# EAGLE design tron_disc (EAGLE 5.11)

## Sheet 1 of 3
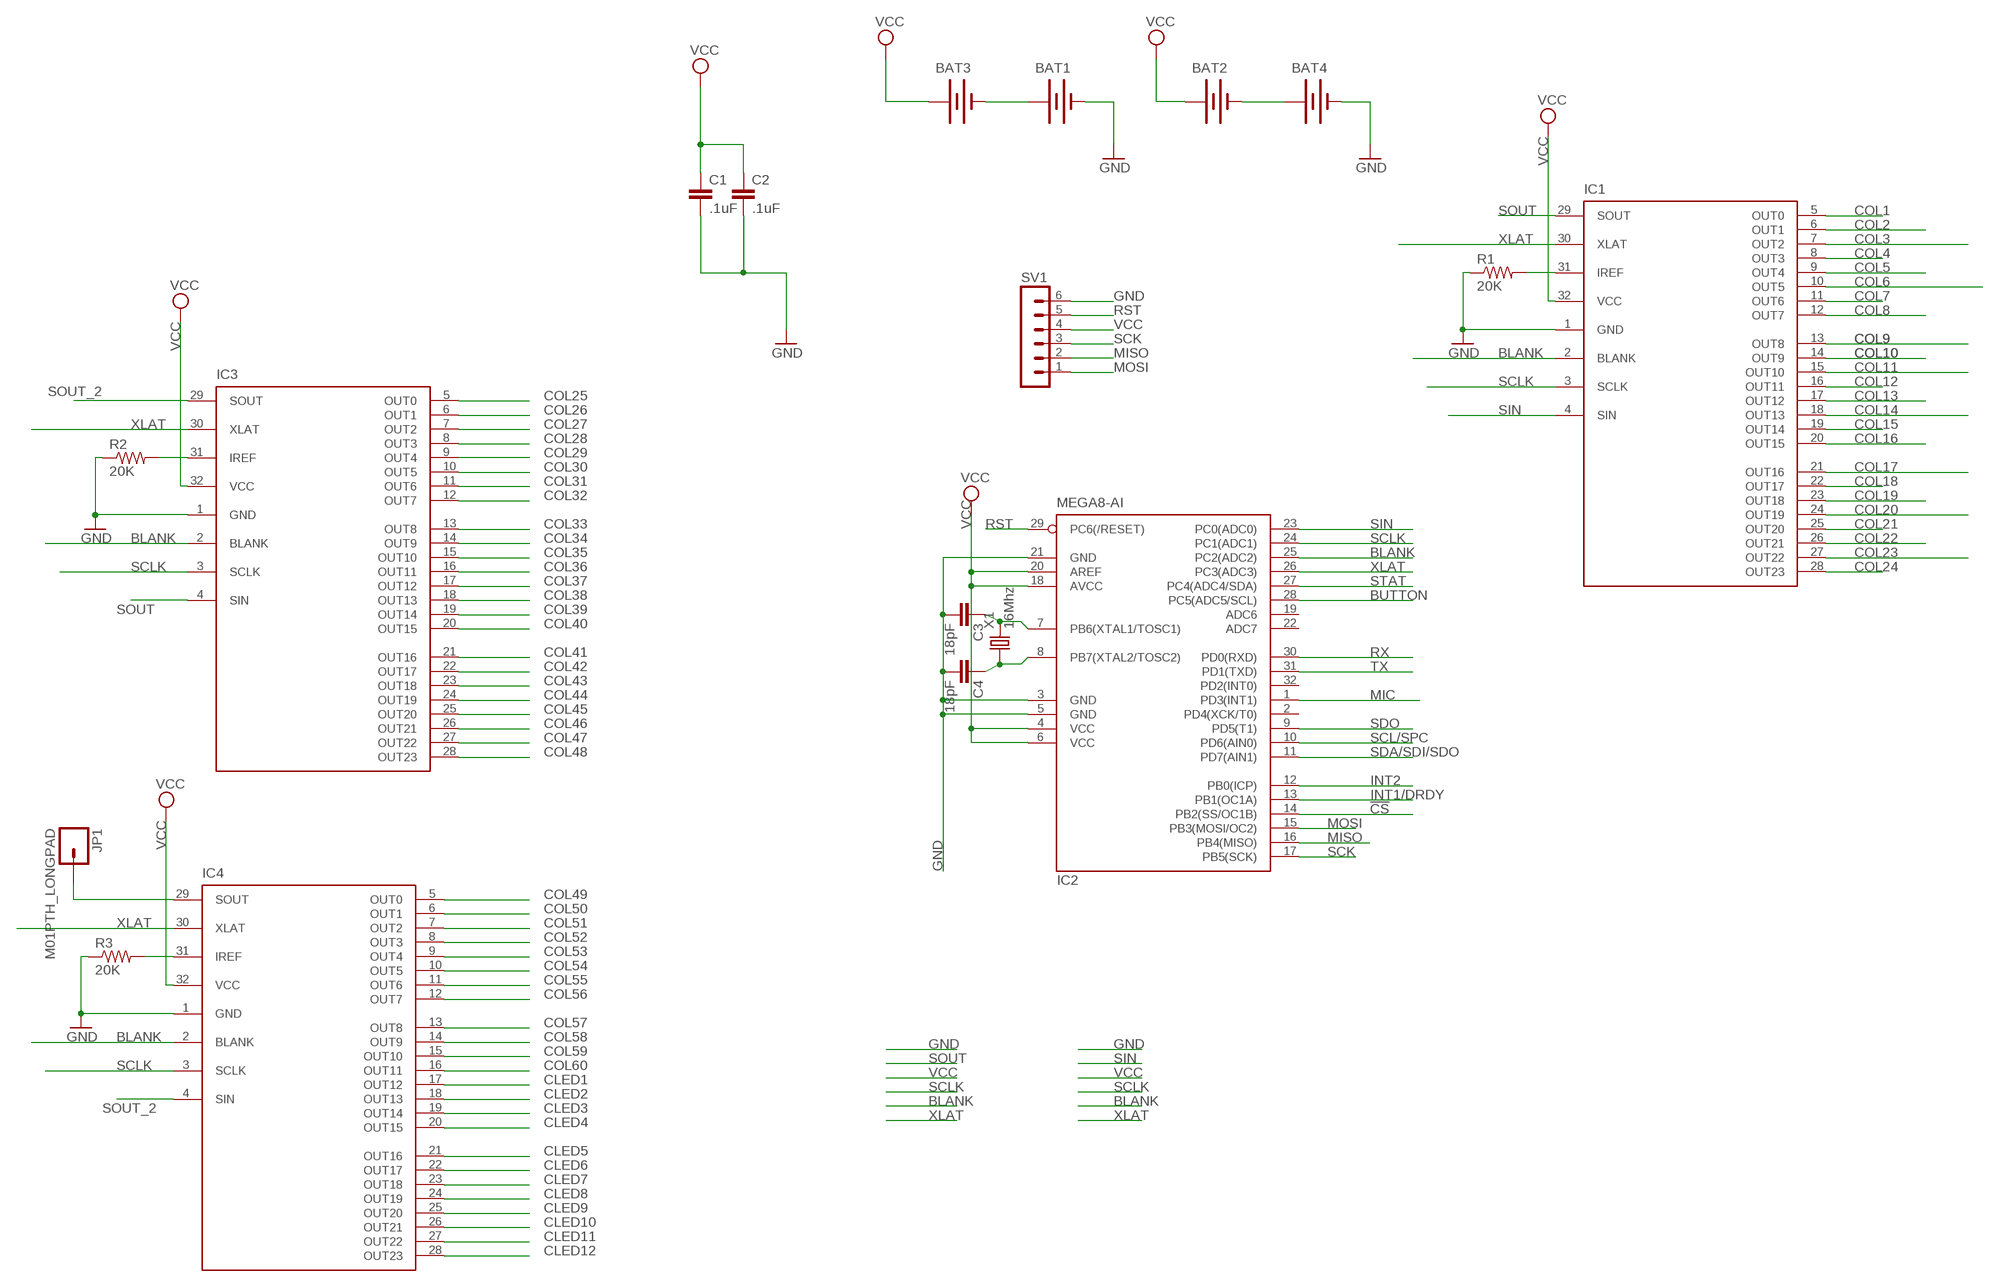
[diagram p0: schematic, sheet 1]

### Parts
BAT1  BATTERY245PTH  [BATTCON_245MM_PTH]
BAT2  BATTERY245PTH  [BATTCON_245MM_PTH]
BAT3  BATTERY245PTH  [BATTCON_245MM_PTH]
BAT4  BATTERY245PTH  [BATTCON_245MM_PTH]
C1  .1uF  CAP0805  [0805]
C2  .1uF  CAP0805  [0805]
C3  18pF  CAP0805  [0805]
C4  18pF  CAP0805  [0805]
IC1  23B_CLOCK_NOLEDS_SLICE_NOSHIFT_TLC5947HTSSOP32DAP  [23B_CLOCK_NOLEDS_HTSSOP32DAP]
IC2  MEGA8-AI  [TQFP32-08]
IC3  23B_CLOCK_NOLEDS_SLICE_NOSHIFT_TLC5947HTSSOP32DAP  [23B_CLOCK_NOLEDS_HTSSOP32DAP]
IC4  23B_CLOCK_NOLEDS_SLICE_NOSHIFT_TLC5947HTSSOP32DAP  [23B_CLOCK_NOLEDS_HTSSOP32DAP]
JP1  M01PTH_LONGPAD  [1X01_LONGPAD]
R1  20K  R-US_R0805  [R0805]
R2  20K  R-US_R0805  [R0805]
R3  20K  R-US_R0805  [R0805]
SV1  MA06-1  [MA06-1]
X1  16Mhz  CRYSTAL-5032  [5032]

### Nets
!CS: IC2.14(PB2(SS/OC1B))
BLANK: IC1.2(BLANK) IC2.25(PC2(ADC2)) IC3.2(BLANK) IC4.2(BLANK)
BUTTON: IC2.28(PC5(ADC5/SCL)) ; also sheet 3
CLED1: IC4.17(OUT12) ; also sheet 2
CLED2: IC4.18(OUT13) ; also sheet 2
CLED3: IC4.19(OUT14) ; also sheet 2
CLED4: IC4.20(OUT15) ; also sheet 2
CLED5: IC4.21(OUT16) ; also sheet 2
CLED6: IC4.22(OUT17) ; also sheet 2
CLED7: IC4.23(OUT18) ; also sheet 2
CLED8: IC4.24(OUT19) ; also sheet 2
CLED9: IC4.25(OUT20) ; also sheet 2
CLED10: IC4.26(OUT21) ; also sheet 2
CLED11: IC4.27(OUT22) ; also sheet 2
CLED12: IC4.28(OUT23) ; also sheet 2
COL1: IC1.5(OUT0) ; also sheet 2
COL2: IC1.6(OUT1) ; also sheet 2
COL3: IC1.7(OUT2) ; also sheet 2
COL4: IC1.8(OUT3) ; also sheet 2
COL5: IC1.9(OUT4) ; also sheet 2
COL6: IC1.10(OUT5) ; also sheet 2
COL7: IC1.11(OUT6) ; also sheet 2
COL8: IC1.12(OUT7) ; also sheet 2
COL9: IC1.13(OUT8) ; also sheet 2
COL10: IC1.14(OUT9) ; also sheet 2
COL11: IC1.15(OUT10) ; also sheet 2
COL12: IC1.16(OUT11) ; also sheet 2
COL13: IC1.17(OUT12) ; also sheet 2
COL14: IC1.18(OUT13) ; also sheet 2
COL15: IC1.19(OUT14) ; also sheet 2
COL16: IC1.20(OUT15) ; also sheet 2
COL17: IC1.21(OUT16) ; also sheet 2
COL18: IC1.22(OUT17) ; also sheet 2
COL19: IC1.23(OUT18) ; also sheet 2
COL20: IC1.24(OUT19) ; also sheet 2
COL21: IC1.25(OUT20) ; also sheet 2
COL22: IC1.26(OUT21) ; also sheet 2
COL23: IC1.27(OUT22) ; also sheet 2
COL24: IC1.28(OUT23) ; also sheet 2
COL25: IC3.5(OUT0) ; also sheet 2
COL26: IC3.6(OUT1) ; also sheet 2
COL27: IC3.7(OUT2) ; also sheet 2
COL28: IC3.8(OUT3) ; also sheet 2
COL29: IC3.9(OUT4) ; also sheet 2
COL30: IC3.10(OUT5) ; also sheet 2
COL31: IC3.11(OUT6) ; also sheet 2
COL32: IC3.12(OUT7) ; also sheet 2
COL33: IC3.13(OUT8) ; also sheet 2
COL34: IC3.14(OUT9) ; also sheet 2
COL35: IC3.15(OUT10) ; also sheet 2
COL36: IC3.16(OUT11) ; also sheet 2
COL37: IC3.17(OUT12) ; also sheet 2
COL38: IC3.18(OUT13) ; also sheet 2
COL39: IC3.19(OUT14) ; also sheet 2
COL40: IC3.20(OUT15) ; also sheet 2
COL41: IC3.21(OUT16) ; also sheet 2
COL42: IC3.22(OUT17) ; also sheet 2
COL43: IC3.23(OUT18) ; also sheet 2
COL44: IC3.24(OUT19) ; also sheet 2
COL45: IC3.25(OUT20) ; also sheet 2
COL46: IC3.26(OUT21) ; also sheet 2
COL47: IC3.27(OUT22) ; also sheet 2
COL48: IC3.28(OUT23) ; also sheet 2
COL49: IC4.5(OUT0) ; also sheet 2
COL50: IC4.6(OUT1) ; also sheet 2
COL51: IC4.7(OUT2) ; also sheet 2
COL52: IC4.8(OUT3) ; also sheet 2
COL53: IC4.9(OUT4) ; also sheet 2
COL54: IC4.10(OUT5) ; also sheet 2
COL55: IC4.11(OUT6) ; also sheet 2
COL56: IC4.12(OUT7) ; also sheet 2
COL57: IC4.13(OUT8) ; also sheet 2
COL58: IC4.14(OUT9) ; also sheet 2
COL59: IC4.15(OUT10) ; also sheet 2
COL60: IC4.16(OUT11) ; also sheet 2
GND: BAT1.2(-) BAT4.2(-) C1.2 C2.2 C3.2 C4.2 IC1.1(GND) IC2.3(GND) IC2.5(GND) IC2.21(GND) IC3.1(GND) IC4.1(GND) R1.1 R2.1 R3.1 SV1.6 ; also sheet 3
INT1/DRDY: IC2.13(PB1(OC1A))
INT2: IC2.12(PB0(ICP))
MIC: IC2.1(PD3(INT1))
MISO: IC2.16(PB4(MISO)) SV1.2
MOSI: IC2.15(PB3(MOSI/OC2)) SV1.1
N$1: IC3.31(IREF) R2.2
N$2: IC4.29(SOUT) JP1.1
N$4: BAT1.3(+) BAT3.2(-)
N$5: BAT2.2(-) BAT4.3(+)
N$7: C3.1 IC2.7(PB6(XTAL1/TOSC1)) X1.2
N$8: C4.1 IC2.8(PB7(XTAL2/TOSC2)) X1.1
N$13: IC1.31(IREF) R1.2
N$64: IC4.31(IREF) R3.2
RST: IC2.29(PC6(/RESET)) SV1.5 ; also sheet 3
RX: IC2.30(PD0(RXD))
SCK: IC2.17(PB5(SCK)) SV1.3
SCL/SPC: IC2.10(PD6(AIN0))
SCLK: IC1.3(SCLK) IC2.24(PC1(ADC1)) IC3.3(SCLK) IC4.3(SCLK)
SDA/SDI/SDO: IC2.11(PD7(AIN1))
SDO: IC2.9(PD5(T1))
SIN: IC1.4(SIN) IC2.23(PC0(ADC0))
SOUT: IC1.29(SOUT) IC3.4(SIN)
SOUT_2: IC3.29(SOUT) IC4.4(SIN)
STAT: IC2.27(PC4(ADC4/SDA))
TX: IC2.31(PD1(TXD))
VCC: BAT2.3(+) BAT3.3(+) C1.1 C2.1 IC1.32(VCC) IC2.4(VCC) IC2.6(VCC) IC2.18(AVCC) IC2.20(AREF) IC3.32(VCC) IC4.32(VCC) SV1.4 ; also sheet 2
XLAT: IC1.30(XLAT) IC2.26(PC3(ADC3)) IC3.30(XLAT) IC4.30(XLAT)
Unconnected: IC2.2(PD4(XCK/T0)) IC2.19(ADC6) IC2.22(ADC7) IC2.32(PD2(INT0))

## Sheet 2 of 3
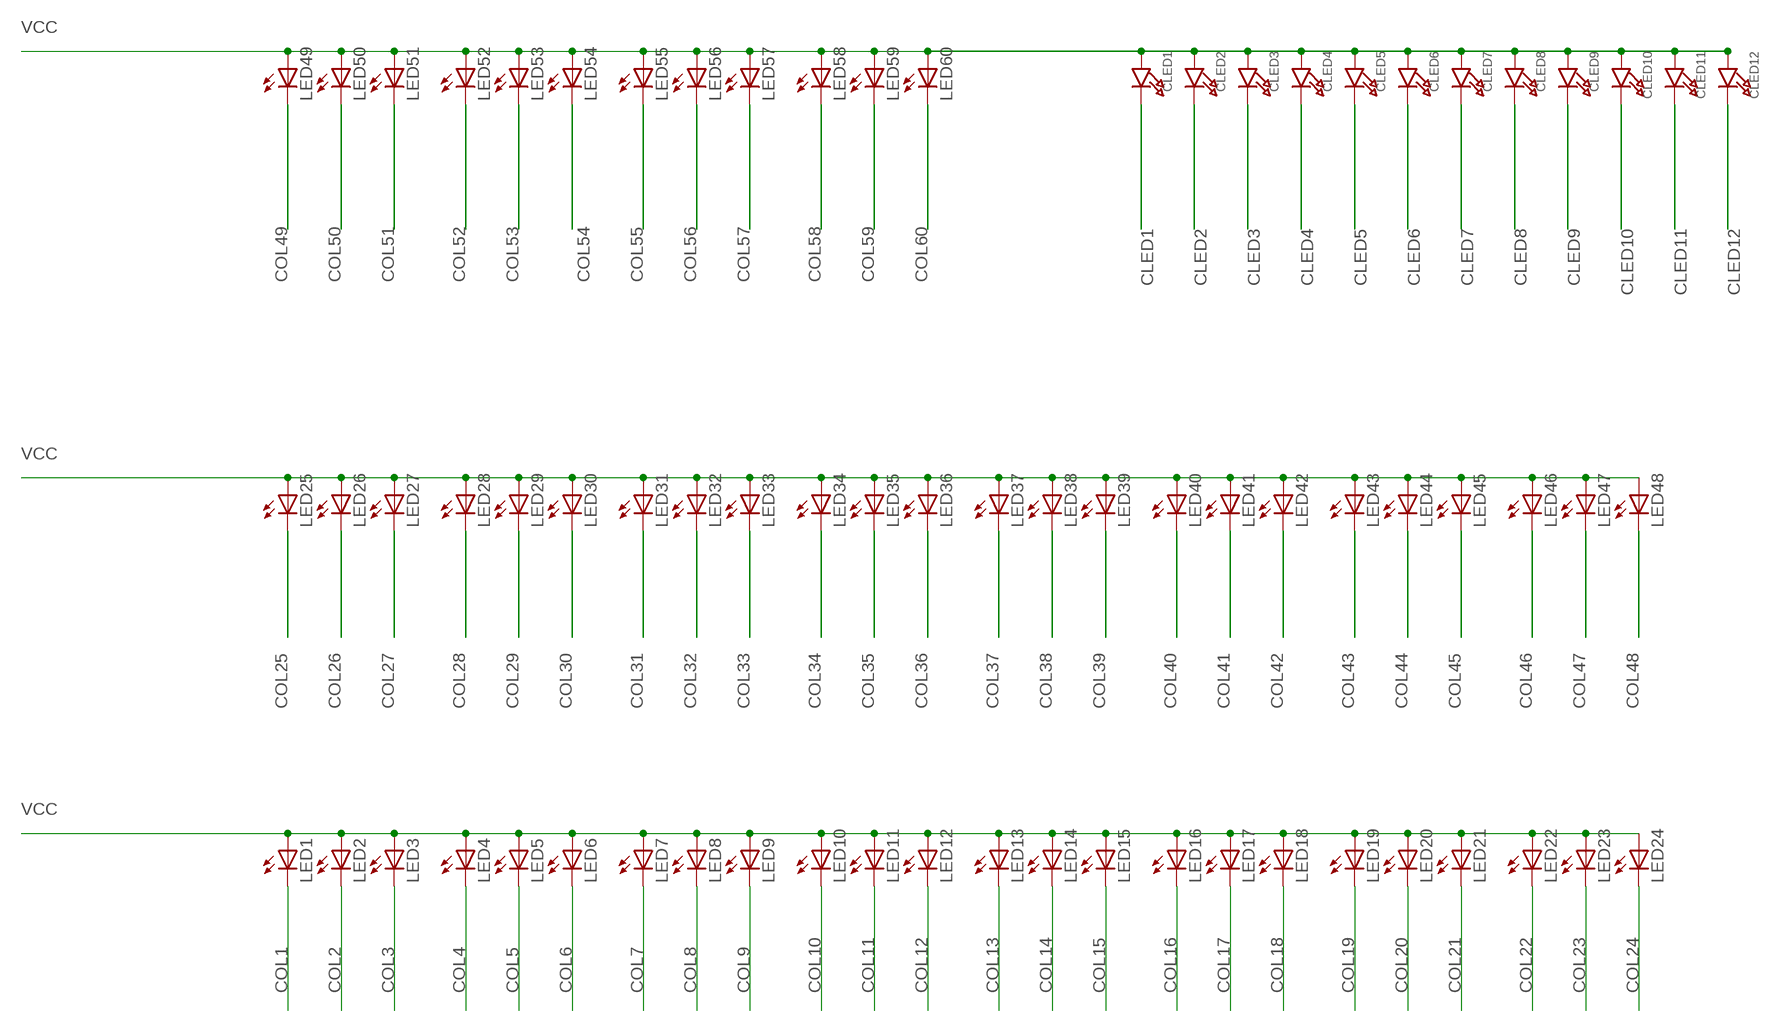
[diagram p1: schematic, sheet 2]

### Parts
CLED1  LED1206  [CHIPLED_1206]
CLED2  LED1206  [CHIPLED_1206]
CLED3  LED1206  [CHIPLED_1206]
CLED4  LED1206  [CHIPLED_1206]
CLED5  LED1206  [CHIPLED_1206]
CLED6  LED1206  [CHIPLED_1206]
CLED7  LED1206  [CHIPLED_1206]
CLED8  LED1206  [CHIPLED_1206]
CLED9  LED1206  [CHIPLED_1206]
CLED10  LED1206  [CHIPLED_1206]
CLED11  LED1206  [CHIPLED_1206]
CLED12  LED1206  [CHIPLED_1206]
LED1  LED5MM  [LED5MM]
LED2  LED5MM  [LED5MM]
LED3  LED5MM  [LED5MM]
LED4  LED5MM  [LED5MM]
LED5  LED5MM  [LED5MM]
LED6  LED5MM  [LED5MM]
LED7  LED5MM  [LED5MM]
LED8  LED5MM  [LED5MM]
LED9  LED5MM  [LED5MM]
LED10  LED5MM  [LED5MM]
LED11  LED5MM  [LED5MM]
LED12  LED5MM  [LED5MM]
LED13  LED5MM  [LED5MM]
LED14  LED5MM  [LED5MM]
LED15  LED5MM  [LED5MM]
LED16  LED5MM  [LED5MM]
LED17  LED5MM  [LED5MM]
LED18  LED5MM  [LED5MM]
LED19  LED5MM  [LED5MM]
LED20  LED5MM  [LED5MM]
LED21  LED5MM  [LED5MM]
LED22  LED5MM  [LED5MM]
LED23  LED5MM  [LED5MM]
LED24  LED5MM  [LED5MM]
LED25  LED5MM  [LED5MM]
LED26  LED5MM  [LED5MM]
LED27  LED5MM  [LED5MM]
LED28  LED5MM  [LED5MM]
LED29  LED5MM  [LED5MM]
LED30  LED5MM  [LED5MM]
LED31  LED5MM  [LED5MM]
LED32  LED5MM  [LED5MM]
LED33  LED5MM  [LED5MM]
LED34  LED5MM  [LED5MM]
LED35  LED5MM  [LED5MM]
LED36  LED5MM  [LED5MM]
LED37  LED5MM  [LED5MM]
LED38  LED5MM  [LED5MM]
LED39  LED5MM  [LED5MM]
LED40  LED5MM  [LED5MM]
LED41  LED5MM  [LED5MM]
LED42  LED5MM  [LED5MM]
LED43  LED5MM  [LED5MM]
LED44  LED5MM  [LED5MM]
LED45  LED5MM  [LED5MM]
LED46  LED5MM  [LED5MM]
LED47  LED5MM  [LED5MM]
LED48  LED5MM  [LED5MM]
LED49  LED5MM  [LED5MM]
LED50  LED5MM  [LED5MM]
LED51  LED5MM  [LED5MM]
LED52  LED5MM  [LED5MM]
LED53  LED5MM  [LED5MM]
LED54  LED5MM  [LED5MM]
LED55  LED5MM  [LED5MM]
LED56  LED5MM  [LED5MM]
LED57  LED5MM  [LED5MM]
LED58  LED5MM  [LED5MM]
LED59  LED5MM  [LED5MM]
LED60  LED5MM  [LED5MM]

### Nets
CLED1: CLED1.C ; also sheet 1
CLED2: CLED2.C ; also sheet 1
CLED3: CLED3.C ; also sheet 1
CLED4: CLED4.C ; also sheet 1
CLED5: CLED5.C ; also sheet 1
CLED6: CLED6.C ; also sheet 1
CLED7: CLED7.C ; also sheet 1
CLED8: CLED8.C ; also sheet 1
CLED9: CLED9.C ; also sheet 1
CLED10: CLED10.C ; also sheet 1
CLED11: CLED11.C ; also sheet 1
CLED12: CLED12.C ; also sheet 1
COL1: LED1.K(C) ; also sheet 1
COL2: LED2.K(C) ; also sheet 1
COL3: LED3.K(C) ; also sheet 1
COL4: LED4.K(C) ; also sheet 1
COL5: LED5.K(C) ; also sheet 1
COL6: LED6.K(C) ; also sheet 1
COL7: LED7.K(C) ; also sheet 1
COL8: LED8.K(C) ; also sheet 1
COL9: LED9.K(C) ; also sheet 1
COL10: LED10.K(C) ; also sheet 1
COL11: LED11.K(C) ; also sheet 1
COL12: LED12.K(C) ; also sheet 1
COL13: LED13.K(C) ; also sheet 1
COL14: LED14.K(C) ; also sheet 1
COL15: LED15.K(C) ; also sheet 1
COL16: LED16.K(C) ; also sheet 1
COL17: LED17.K(C) ; also sheet 1
COL18: LED18.K(C) ; also sheet 1
COL19: LED19.K(C) ; also sheet 1
COL20: LED20.K(C) ; also sheet 1
COL21: LED21.K(C) ; also sheet 1
COL22: LED22.K(C) ; also sheet 1
COL23: LED23.K(C) ; also sheet 1
COL24: LED24.K(C) ; also sheet 1
COL25: LED25.K(C) ; also sheet 1
COL26: LED26.K(C) ; also sheet 1
COL27: LED27.K(C) ; also sheet 1
COL28: LED28.K(C) ; also sheet 1
COL29: LED29.K(C) ; also sheet 1
COL30: LED30.K(C) ; also sheet 1
COL31: LED31.K(C) ; also sheet 1
COL32: LED32.K(C) ; also sheet 1
COL33: LED33.K(C) ; also sheet 1
COL34: LED34.K(C) ; also sheet 1
COL35: LED35.K(C) ; also sheet 1
COL36: LED36.K(C) ; also sheet 1
COL37: LED37.K(C) ; also sheet 1
COL38: LED38.K(C) ; also sheet 1
COL39: LED39.K(C) ; also sheet 1
COL40: LED40.K(C) ; also sheet 1
COL41: LED41.K(C) ; also sheet 1
COL42: LED42.K(C) ; also sheet 1
COL43: LED43.K(C) ; also sheet 1
COL44: LED44.K(C) ; also sheet 1
COL45: LED45.K(C) ; also sheet 1
COL46: LED46.K(C) ; also sheet 1
COL47: LED47.K(C) ; also sheet 1
COL48: LED48.K(C) ; also sheet 1
COL49: LED49.K(C) ; also sheet 1
COL50: LED50.K(C) ; also sheet 1
COL51: LED51.K(C) ; also sheet 1
COL52: LED52.K(C) ; also sheet 1
COL53: LED53.K(C) ; also sheet 1
COL54: LED54.K(C) ; also sheet 1
COL55: LED55.K(C) ; also sheet 1
COL56: LED56.K(C) ; also sheet 1
COL57: LED57.K(C) ; also sheet 1
COL58: LED58.K(C) ; also sheet 1
COL59: LED59.K(C) ; also sheet 1
COL60: LED60.K(C) ; also sheet 1
VCC: CLED1.A CLED2.A CLED3.A CLED4.A CLED5.A CLED6.A CLED7.A CLED8.A CLED9.A CLED10.A CLED11.A CLED12.A LED1.A LED2.A LED3.A LED4.A LED5.A LED6.A LED7.A LED8.A LED9.A LED10.A LED11.A LED12.A LED13.A LED14.A LED15.A LED16.A LED17.A LED18.A LED19.A LED20.A LED21.A LED22.A LED23.A LED24.A LED25.A LED26.A LED27.A LED28.A LED29.A LED30.A LED31.A LED32.A LED33.A LED34.A LED35.A LED36.A LED37.A LED38.A LED39.A LED40.A LED41.A LED42.A LED43.A LED44.A LED45.A LED46.A LED47.A LED48.A LED49.A LED50.A LED51.A LED52.A LED53.A LED54.A LED55.A LED56.A LED57.A LED58.A LED59.A LED60.A ; also sheet 1

## Sheet 3 of 3
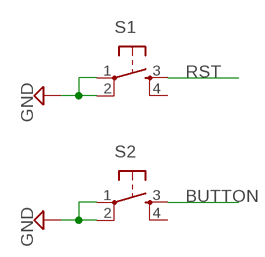
[diagram p2: schematic, sheet 3]

### Parts
S1  TAC_SWITCHSMD  [TACTILE_SWITCH_SMD]
S2  TAC_SWITCHSMD  [TACTILE_SWITCH_SMD]

### Nets
BUTTON: S2.3 ; also sheet 1
GND: S1.1 S1.2 S2.1 S2.2 ; also sheet 1
RST: S1.3 ; also sheet 1
Unconnected: S1.4 S2.4

## Library data of the parts
BAT1-BAT4 = SparkFun:BATTERY: Battery Holders Various common sizes : AA, AAA, 20mm coin cell and 12mm coin cell.
C1-C4 = slice_noshift:CAP: Capacitor Standard 0603 ceramic capacitor, and 0.1" leaded capacitor.
CLED1-CLED12 = microbuilder:LED: LED
IC1 IC3 IC4 = tron_disc:23B_CLOCK_NOLEDS_SLICE_NOSHIFT_TLC5947
IC2 = atmel:MEGA8: MICROCONTROLLER 8 Kbytes FLASH, 1 kbytes SRAM, 512 bytes EEPROM, USART, 6-channel 10 bit ADC, 2-channel 8 bit ADC Pin compatible with Atmega48, ATMega88, ATMega168 Source: avr.lbr; MPN: ATMEGA8-16AU; OC_FARNELL: 9171371; OC_NEWARK: 73M8863
JP1 = SparkFun:M01: Header 1 Standard 1-pin 0.1" header. Use with straight break away headers (SKU : PRT-00116), right angle break away headers (PRT-00553), swiss pins (PRT-00743), machine pins (PRT-00117), and female headers (PRT-00115).
LED1-LED60 = led:LED: LED
R1-R3 = rcl:R-US_: RESISTOR, American symbol
S1 S2 = SparkFun:TAC_SWITCH: Momentary Switch Button commonly used for reset or general input. Spark Fun Electronics SKU : COM-00097
SV1 = NSL:MA06-1: PIN HEADER
X1 = NSL_MiniQuad:CRYSTAL*: CRYSTAL

## Net classes
0 default: width 0.254 mm

## Board
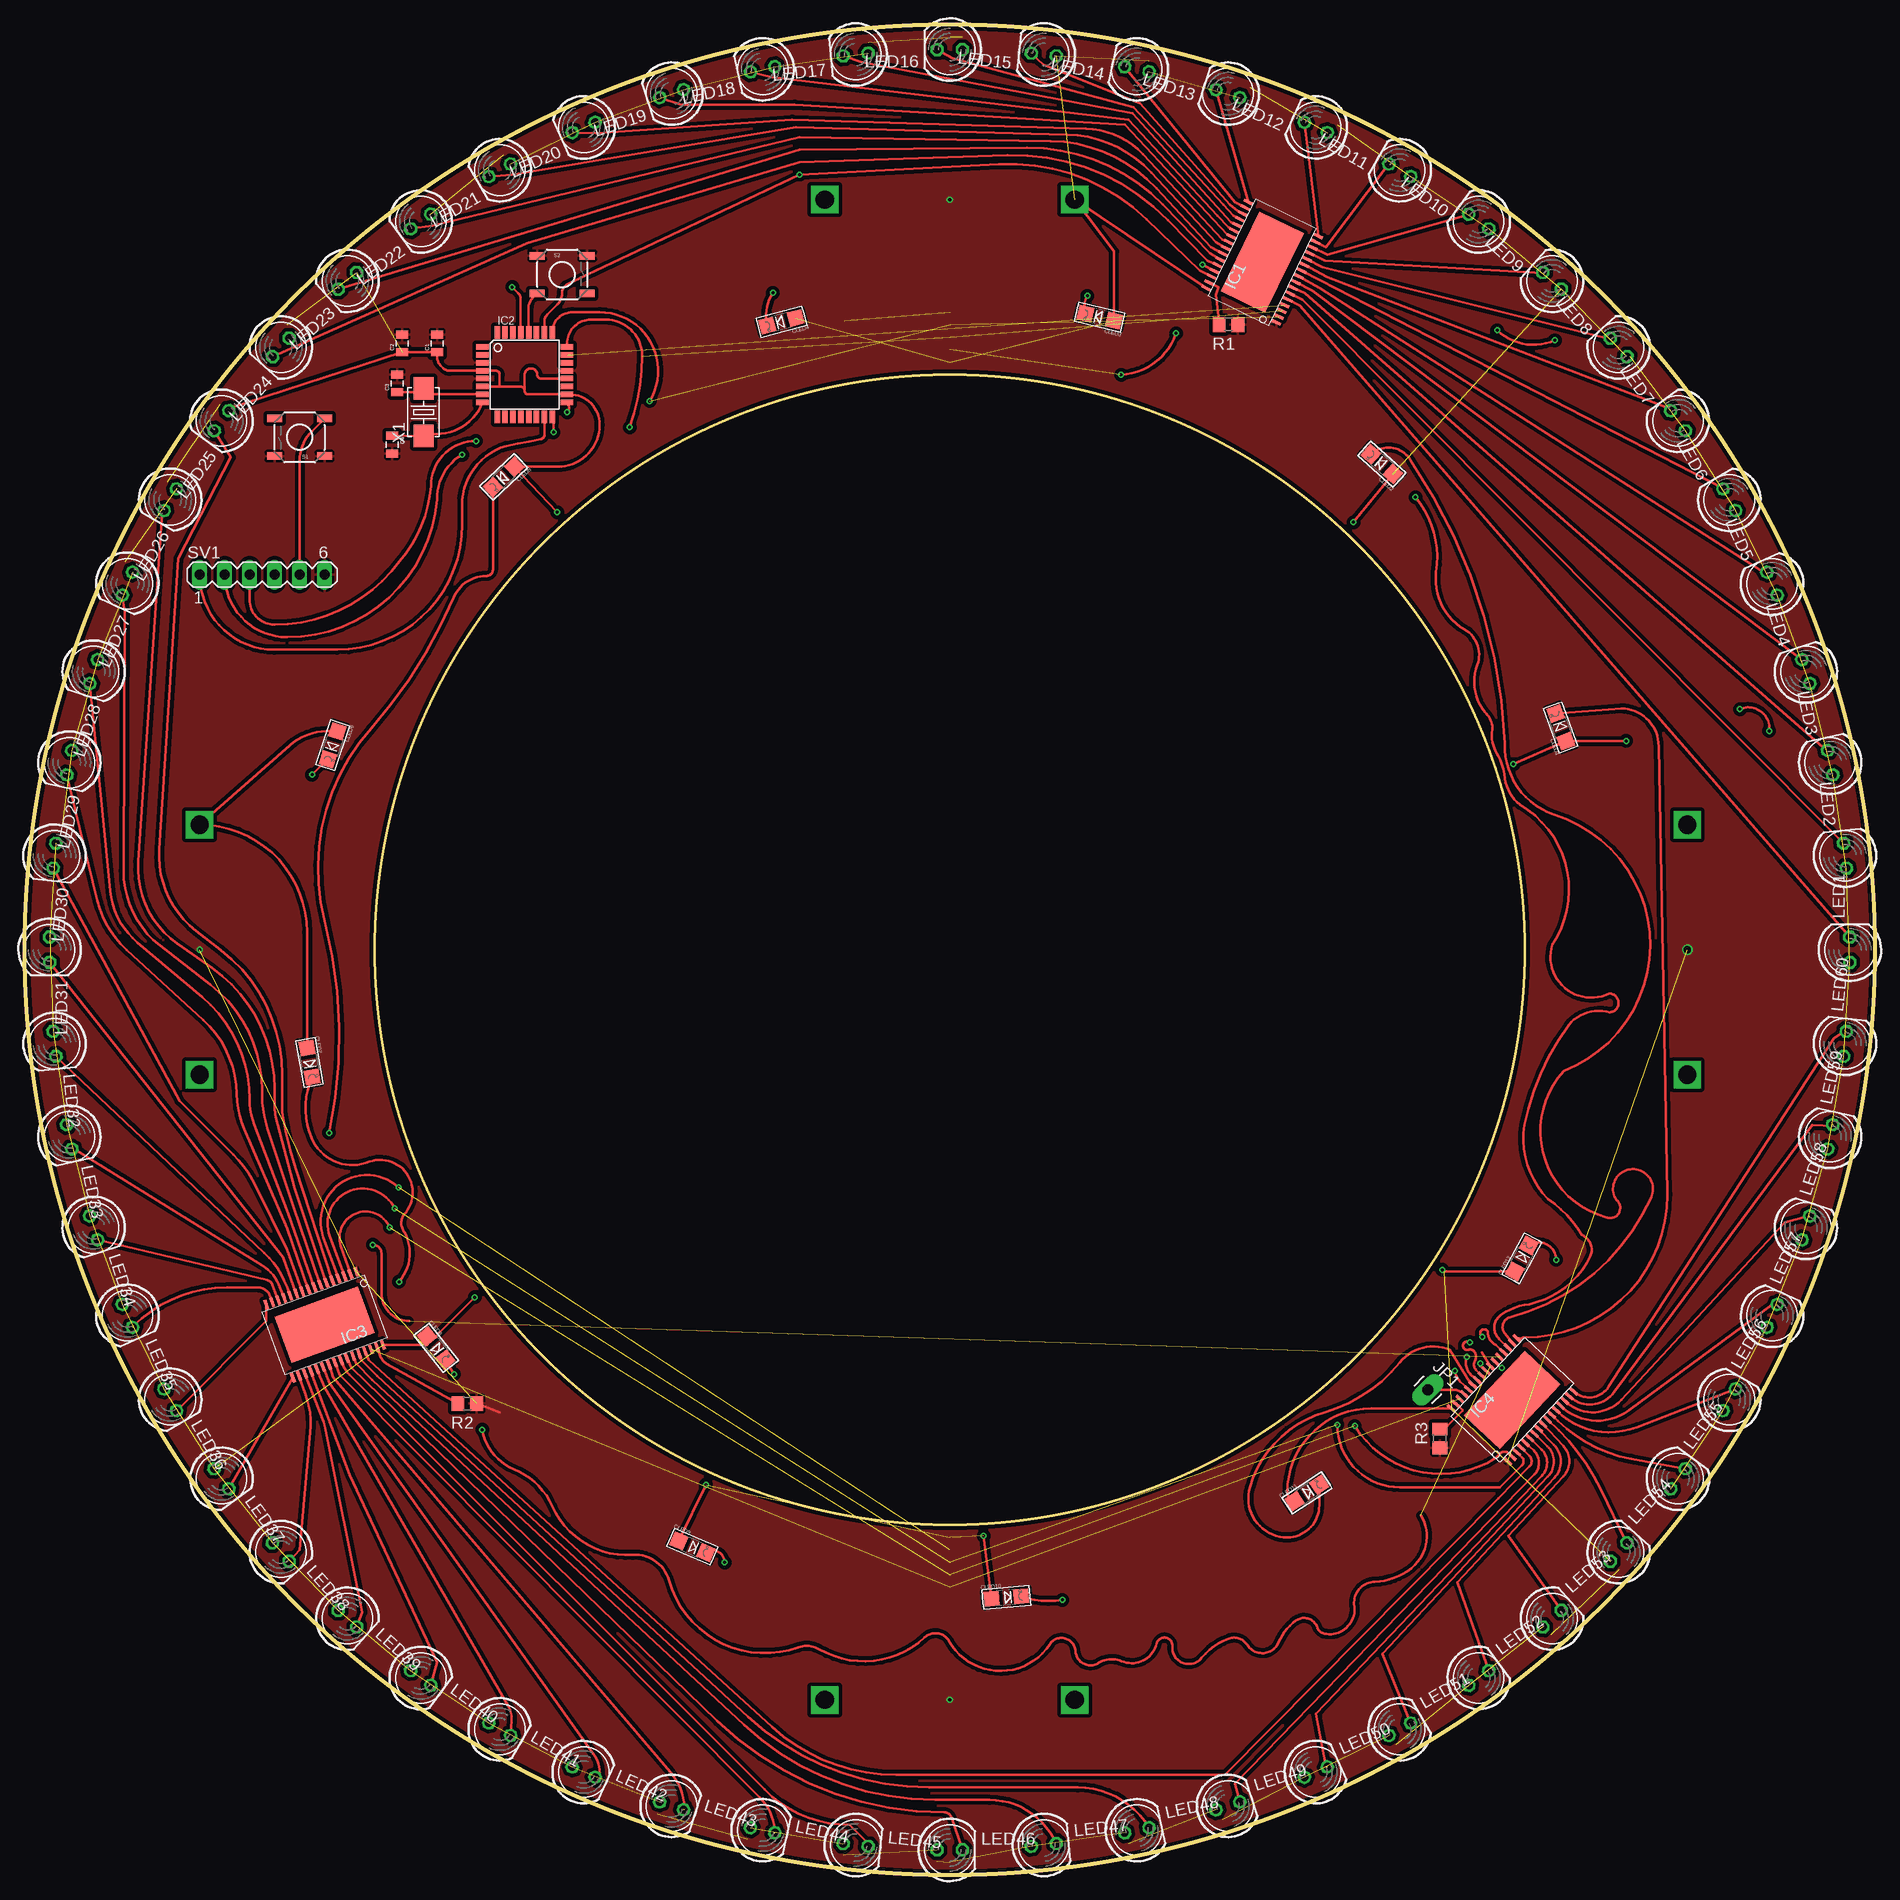
[diagram p3: board, top side]
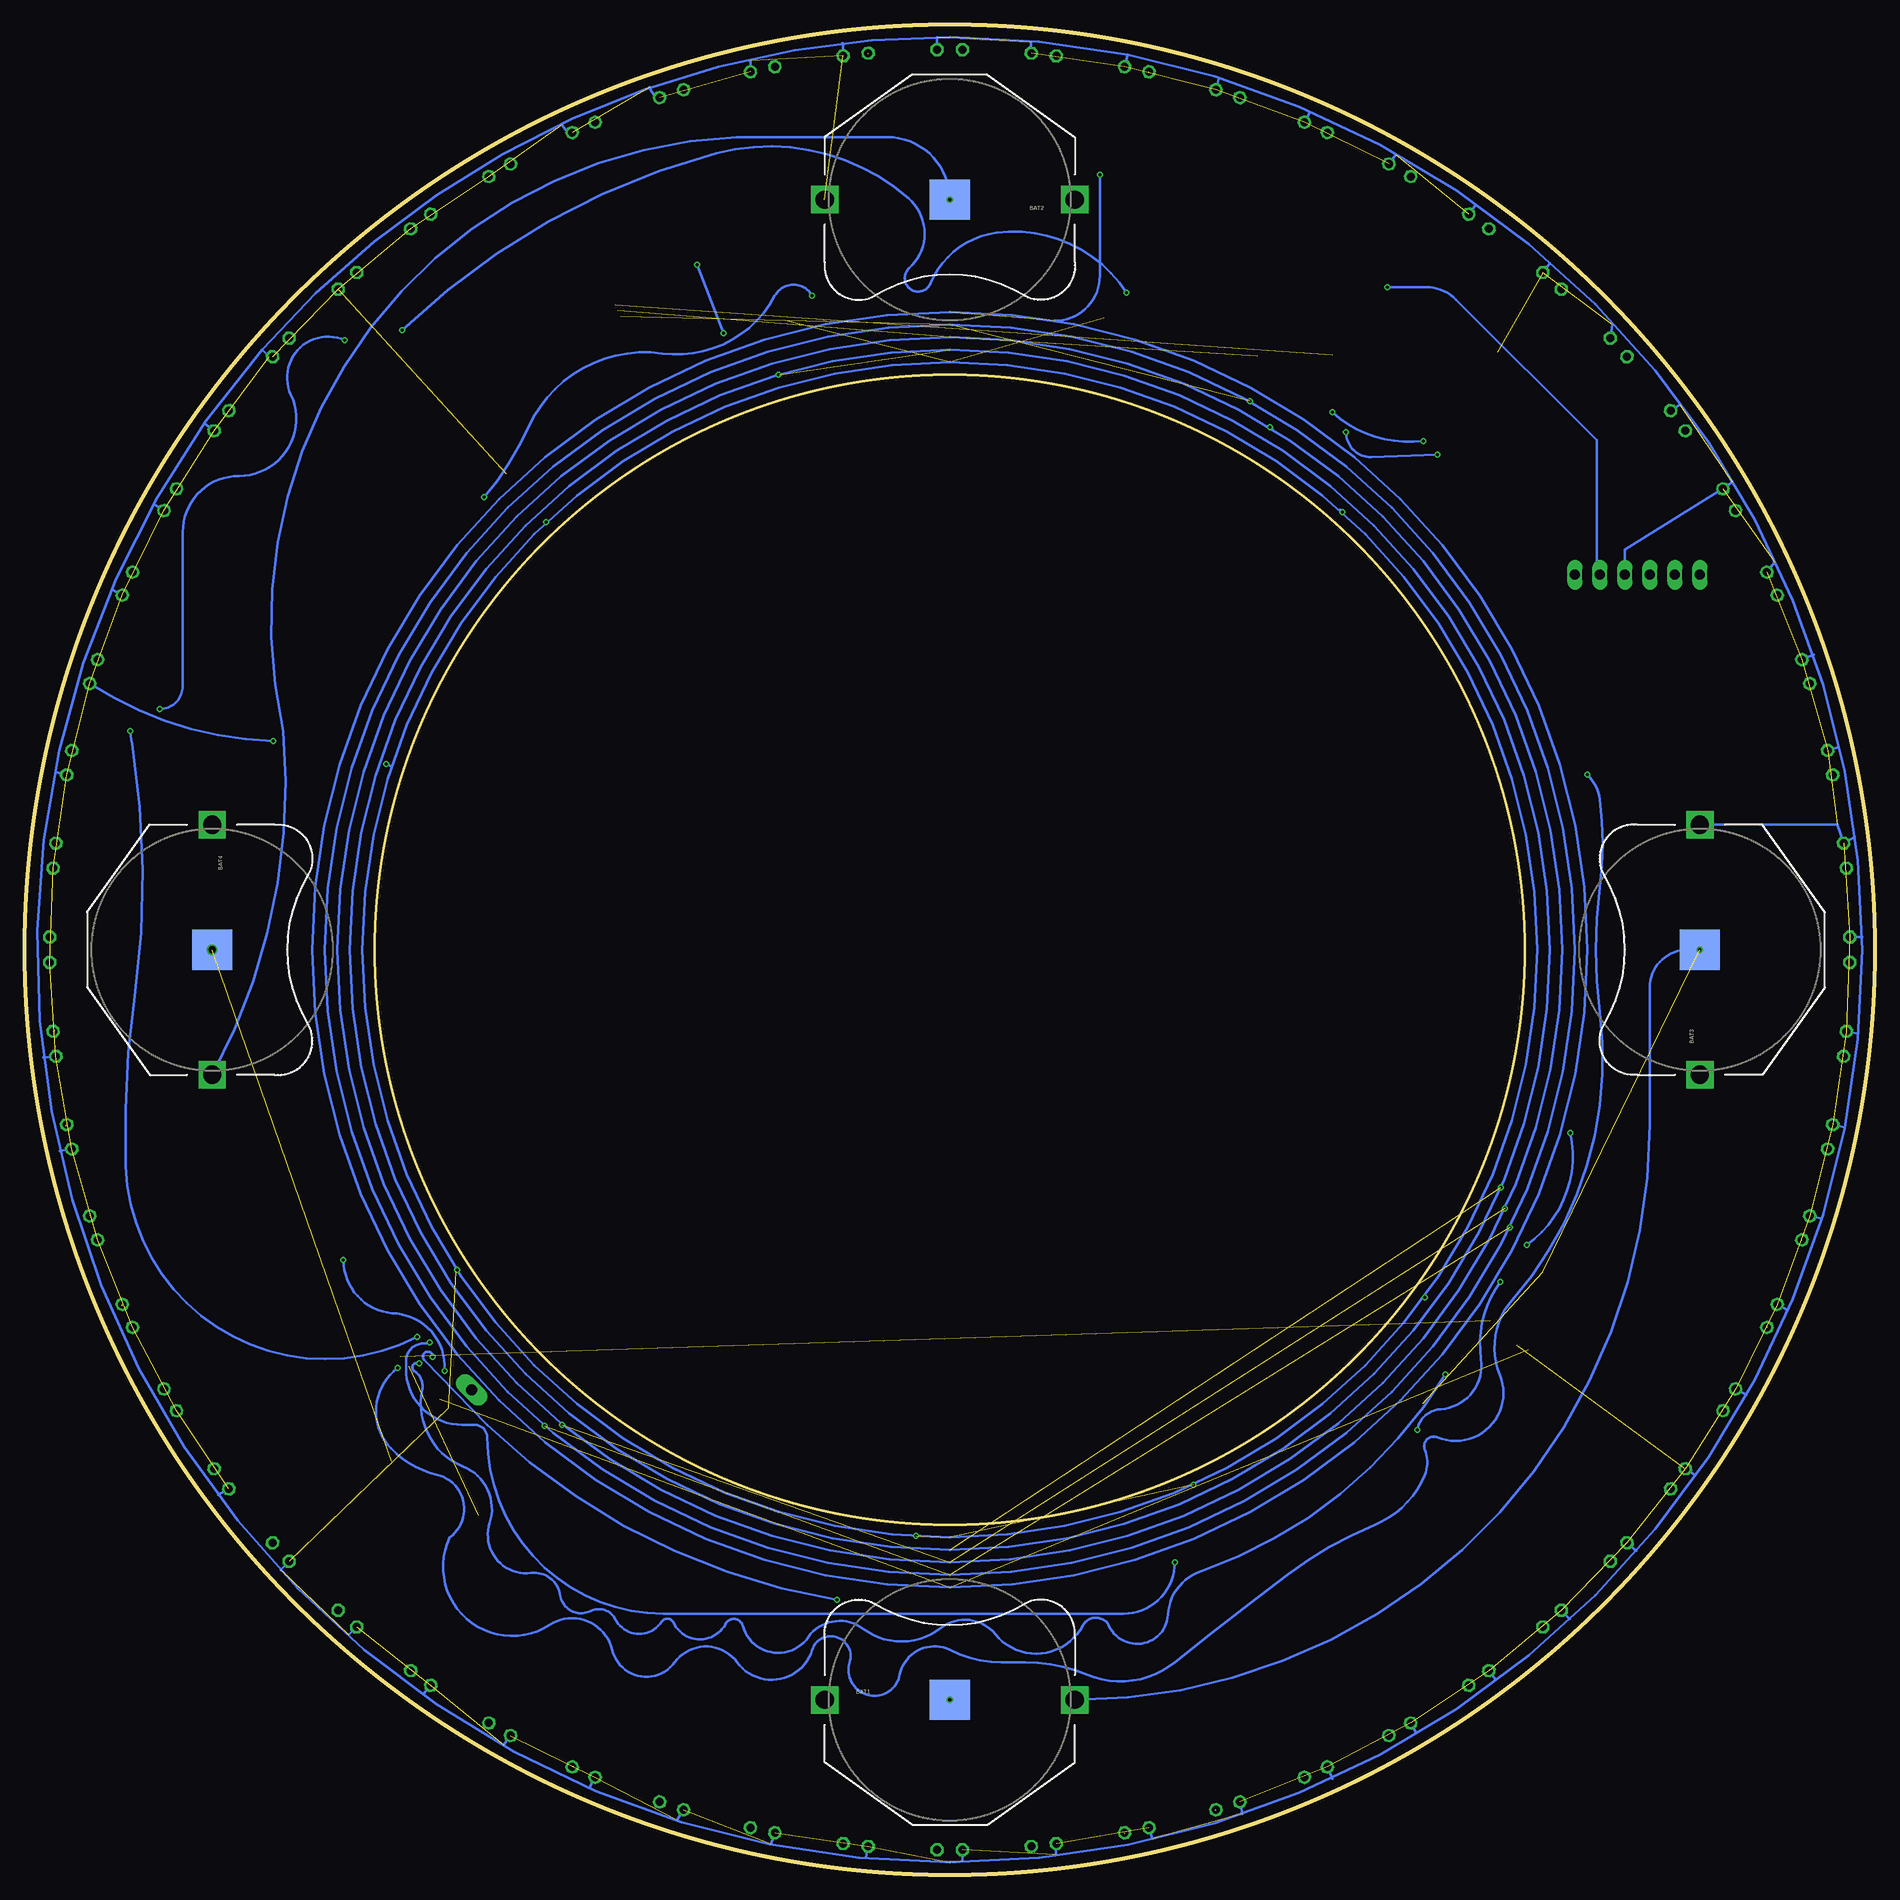
[diagram p4: board, bottom side, seen from below]

Size 187.96 x 187.96 mm. Coordinates in mm from the lower left corner, seen from the top.
Outline: circle at 93.98,93.98 radius 93.98
Outline: circle at 93.98,93.98 radius 58.42
Copper layers (1*16): Top 0.035mm / dielectric 1.5mm / Bottom 0.035mm
Design rules "ITead_rule": minimum track width 6mil, minimum drill 12mil, track to track 6mil, track to pad 6mil, pad to pad 6mil, via to via 6mil, smd to smd 0mil, copper to edge 10mil, drill to drill 10mil, minimum pad ring 10mil, minimum via ring 6mil, stop-mask expansion 2mil, vias tented up to drill 100mil, thermal gap 10mil

### Footprints (pad centres in the part's own frame; a part is rotated, then mirrored left to right if it is on the bottom)
BATTCON_245MM_PTH = drill 1.854 square: 1 -12.7,0; 3 12.7,0 | smd 4.064 x 4.064: 2 0,0
0805 = smd 0.8 x 1.2: 1 -0.9,0; 2 0.9,0
CHIPLED_1206 = smd 1.5 x 1.5: A 0,-1.496; C 0,1.496
23B_CLOCK_NOLEDS_HTSSOP32DAP = smd 0.3 x 1: 1 -4.875,-3.95; 2 -4.225,-3.95; 3 -3.575,-3.95; 4 -2.925,-3.95; 5 -2.275,-3.95; 6 -1.625,-3.95; 7 -0.975,-3.95; 8 -0.325,-3.95; 9 0.325,-3.95; 10 0.975,-3.95; 11 1.625,-3.95; 12 2.275,-3.95; 13 2.925,-3.95; 14 3.575,-3.95; 15 4.225,-3.95; 16 4.875,-3.95; 17 4.875,3.95; 18 4.225,3.95; 19 3.575,3.95; 20 2.925,3.95; 21 2.275,3.95; 22 1.625,3.95; 23 0.975,3.95; 24 0.325,3.95; 25 -0.325,3.95; 26 -0.975,3.95; 27 -1.625,3.95; 28 -2.275,3.95; 29 -2.925,3.95; 30 -3.575,3.95; 31 -4.225,3.95; 32 -4.875,3.95 | smd 9 x 5: EXP 0,0
TQFP32-08 = smd 1.27 x 0.559: 1 -4.293,2.8; 2 -4.293,2; 3 -4.293,1.2; 4 -4.293,0.4; 5 -4.293,-0.4; 6 -4.293,-1.2; 7 -4.293,-2; 8 -4.293,-2.8; 17 4.293,-2.8; 18 4.293,-2; 19 4.293,-1.2; 20 4.293,-0.4; 21 4.293,0.4; 22 4.293,1.2; 23 4.293,2; 24 4.293,2.8 | smd 0.559 x 1.27: 9 -2.8,-4.293; 10 -2,-4.293; 11 -1.2,-4.293; 12 -0.4,-4.293; 13 0.4,-4.293; 14 1.2,-4.293; 15 2,-4.293; 16 2.8,-4.293; 25 2.8,4.293; 26 2,4.293; 27 1.2,4.293; 28 0.4,4.293; 29 -0.4,4.293; 30 -1.2,4.293; 31 -2,4.293; 32 -2.8,4.293
1X01_LONGPAD = drill 1.118 pad 1.88 long: 1 0,0
LED5MM = drill 0.813 octagon: A -1.27,0; K 1.27,0
R0805 = smd 1.3 x 1.5: 1 -0.95,0; 2 0.95,0
TACTILE_SWITCH_SMD = smd 1.524 x 0.762: 1 -2.54,1.905; 2 2.54,1.905; 3 -2.54,-1.905; 4 2.54,-1.905
MA06-1 = drill 1.016 long: 1 -6.35,0; 2 -3.81,0; 3 -1.27,0; 4 1.27,0; 5 3.81,0; 6 6.35,0
5032 = smd 2.286 x 2.032: 1 -2.413,0; 2 2.413,0

### Placement (x,y rotation side)
BAT1  93.98,17.78 0 bottom
BAT2  93.98,170.18 180 bottom
BAT3  17.78,93.98 90 bottom
BAT4  168.91,93.98 270 bottom
C1  41.91,155.57 90 top
C2  38.35,155.57 90 top
C3  37.85,151.51 90 top
C4  37.34,145.29 270 top
CLED1  156.04,116.57 20 top
CLED2  137.88,143.31 48.3 top
CLED3  109.21,158.24 76.7 top
CLED4  76.89,157.77 105 top
CLED5  48.66,142.02 133.3 top
CLED6  31.29,114.75 161.7 top
CLED7  28.94,82.51 190 top
CLED8  41.8,53.53 218.3 top
CLED9  67.82,33.34 246.7 top
CLED10  99.74,28.19 275 top
CLED11  130.27,38.8 303.3 top
CLED12  152.11,62.64 331.7 top
IC1  125.73,163.83 64 top
IC2  50.8,152.4 0 top
IC3  30.48,55.88 200 top
IC4  151.13,48.26 46.9 top
JP1  142.56,49.28 315 top
LED1  185.42,93.98 90 top
LED2  184.92,103.54 96 top
LED3  183.42,112.99 102 top
LED4  180.94,122.24 108 top
LED5  177.52,131.17 114 top
LED6  173.17,139.7 120 top
LED7  167.96,147.73 126 top
LED8  161.93,155.17 132 top
LED9  155.17,161.93 138 top
LED10  147.73,167.96 144 top
LED11  139.7,173.17 150 top
LED12  131.17,177.52 156 top
LED13  122.24,180.94 162 top
LED14  112.99,183.42 168 top
LED15  103.54,184.92 174 top
LED16  93.98,185.42 180 top
LED17  84.42,184.92 186 top
LED18  74.97,183.42 192 top
LED19  65.72,180.94 198 top
LED20  56.79,177.52 204 top
LED21  48.26,173.17 210 top
LED22  40.23,167.96 216 top
LED23  32.79,161.93 222 top
LED24  26.03,155.17 228 top
LED25  20,147.73 234 top
LED26  14.79,139.7 240 top
LED27  10.44,131.17 246 top
LED28  7.02,122.24 252 top
LED29  4.54,112.99 258 top
LED30  3.04,103.54 264 top
LED31  2.54,93.98 270 top
LED32  3.04,84.42 276 top
LED33  4.54,74.97 282 top
LED34  7.02,65.72 288 top
LED35  10.44,56.79 294 top
LED36  14.79,48.26 300 top
LED37  20,40.23 306 top
LED38  26.03,32.79 312 top
LED39  32.79,26.03 318 top
LED40  40.23,20 324 top
LED41  48.26,14.79 330 top
LED42  56.79,10.44 336 top
LED43  65.72,7.02 342 top
LED44  74.97,4.54 348 top
LED45  84.42,3.04 354 top
LED46  93.98,2.54 0 top
LED47  103.54,3.04 6 top
LED48  112.99,4.54 12 top
LED49  122.24,7.02 18 top
LED50  131.17,10.44 24 top
LED51  139.7,14.79 30 top
LED52  147.73,20 36 top
LED53  155.17,26.03 42 top
LED54  161.93,32.79 48 top
LED55  167.96,40.23 54 top
LED56  173.17,48.26 60 top
LED57  177.52,56.79 66 top
LED58  180.94,65.72 72 top
LED59  183.42,74.97 78 top
LED60  184.92,84.42 84 top
R1  122.3,157.48 180 top
R2  44.96,47.88 180 top
R3  143.76,44.32 90 top
S1  27.94,146.05 180 top
S2  54.61,162.56 0 top
SV1  24.13,132.08 0 top
X1  40.51,148.59 90 top

### Tracks (layer width: path | path; a pad name or v marks a point on that pad's centre or on a via)
BLANK  (via drill 0.3)  (4 unrouted)
  Top 0.254: IC3.2 32.13,63.88 arc-176 v37.08,65.79 | IC4.2 150.62,42.93 arc69 149.86,42.8 arc-23 149.35,42.29 arc-90 v135.13,45.59 | IC2.25 arc-90 55.66,158.75 58.42,158.75 arc-121 v63.5,149.73
  Bottom 0.254: v63.5,149.73 63.37,149.61 | 93.98,30.48 arc-180 93.98,157.48 arc-180 93.98,30.48
BUTTON
  Top 0.254: IC2.28 51.2,159.23 arc-45 51.6,160.18 S2.3
CLED1
  Top 0.254: IC4.17 152.18,54.52 arc-90 152.27,54.61 152.4,54.61 arc90 166.88,69.09 166.88,69.22 165.99,114.68 arc90 162.19,118.48 CLED1.C
CLED2
  Top 0.254: IC4.18 150.37,54.99 arc-112 150.88,56.64 arc51 165.23,68.83 arc237 161.67,68.58 arc-166 160.66,66.8 arc-117 156.34,81.66 arc142 155.32,107.7 arc-73 150.37,114.94 arc32 140.78,143.7 arc103 CLED2.C
CLED3  (via drill 0.3)
  Top 0.254: v141.29,139.95 arc-48 143.38,132.33 arc67 146.3,126.49 arc-81 147.57,122.94 arc59 148.34,118.11 arc-51 149.1,116.33 arc46 149.73,113.67 arc-20 150.37,111.38 arc42 151.89,108.71 arc-94 155.19,94.49 arc134 160.97,89.53 arc-176 161.04,87.63 arc64 156.84,86.36 arc21 152.78,77.79 arc64 154.75,68.64 arc-25 158.18,65.02 arc-90 159.07,62.87 arc-52 152.84,57.98 arc28 149.99,56.9 arc102 149.8,54.42 IC4.19 | v107.95,160.4 arc44 CLED3.C
  Bottom 0.254: v141.29,139.95 arc-17 136.78,147.07 arc73 123.19,154.56 arc-70 111.76,160.4 arc124 v107.95,160.4
CLED4  (via drill 0.3)
  Top 0.254: IC4.20 149.48,53.85 arc-61 148.65,54.93 arc257 v148.08,54.67 | v177.23,116.21 arc121 v174.24,118.43 | v155.45,155.89 arc-68 v149.61,156.91 | v76.01,160.72 arc47 CLED4.C
  Bottom 0.254: v148.08,54.67 arc115 177.67,71.95 arc10 176.78,89.28 arc-17 177.04,114.87 arc2 v177.23,116.21 | v174.24,118.43 arc-90 171.9,120.78 171.9,136.4 arc90 166.18,142.11 arc-115 160.91,150.37 arc139 v155.45,155.89 | v149.61,156.91 arc29 117.67,174.88 arc56 98.17,170.31 arc97 98.11,163.19 arc-205 95.95,161.67 arc60 89.22,166.81 arc64 v76.01,160.72
CLED5  (via drill 0.3)  (1 unrouted)
  Top 0.254: CLED5.C 47.57,132.6 arc-90 46.93,131.95 arc67 43.56,129.73 arc-18 35.18,116.46 arc56 30.48,96.9 arc-26 v30.92,75.38 | v35.37,64.01 arc-90 36.26,63.12 36.26,59.06 arc90 39.05,56.26
  Bottom 0.254: v30.92,75.38 arc67 v35.37,64.01
CLED6  (via drill 0.3)
  Top 0.254: v29.21,111.76 CLED6.C | v150.05,51.5 149.92,51.58 IC4.22
  Bottom 0.254: v29.21,111.76 arc38 27.94,109.22 arc15 27.94,100.33 arc-15 27.94,87.63 arc49 36.83,58.42 arc-64 38.1,50.8 arc135 44.45,44.45 arc-135 45.72,43.18 arc45 45.72,40.64 arc45 50.8,35.56 arc-15 59.69,30.48 arc-1 71.12,21.59 arc61 80.01,20.32 arc-26 87.63,21.59 arc29 93.98,22.86 arc-105 99.06,20.32 arc186 104.14,21.59 arc-88 105.41,24.13 arc-92 107.95,22.86 arc127 115.57,21.59 arc-108 121.92,21.59 arc130 128.27,22.86 arc-109 134.62,25.4 arc148 144.78,34.29 arc-131 146.05,40.64 arc33 150.75,43.31 arc97 v150.05,51.5
CLED7  (via drill 0.3)  (1 unrouted)
  Top 0.254: IC4.23 148.02,53.09 | v46.48,45.21 arc58 49.72,41.21 arc-44 53.59,37.47 arc70 61.79,32.51 arc-78 65.47,29.91 arc94 78.61,23.11 arc-50 80.71,22.92 arc73 91.44,24.13 arc-103 93.92,23.75 arc117 104.14,23.43 arc-144 106.74,22.73 arc119 109.09,21.53 arc-56 111.44,21.72 arc99 115,23.5 arc-171 116.59,23.24 arc145 119.57,22.04 arc-29 122.3,24 arc-79 124.21,23.37 arc125 127.38,23.62 arc-32 129.16,25.84 arc-107 131.32,25.15 arc58 132.02,24.51 arc111 135.06,27.31 arc-97 137.16,29.78 arc43 141.22,31.5 arc77 141.86,36.51 | v38.04,60.26 arc69 38.61,65.28 arc-87 38.74,67.31 arc147 35.05,72.45 arc-90 29.14,74.87 arc-47 CLED7.C
  Bottom 0.254: v38.04,60.26 arc-45 40.01,52.39 arc95 44.13,47.31 arc-77 v46.48,45.21
CLED8  (via drill 0.3)
  Top 0.254: IC4.24 147.89,51.69 arc-118 v147.89,51.94 | v43.63,50.86 arc0 CLED8.C
  Bottom 0.254: v147.89,51.94 arc-170 148.4,51.18 arc70 147.57,49.28 arc-80 143.38,41.47 arc86 140.72,35.75 arc-115 136.53,30.67 arc89 133.54,28.38 arc-109 130.49,26.8 arc90 127.95,25.97 arc-120 123.25,25.72 arc120 122.05,25.65 arc-127 116.78,25.46 arc141 115,25.27 arc-130 108.33,24.19 arc91 102.81,25.02 arc-74 94.87,25.08 arc88 89.34,24.45 arc-113 80.45,25.34 arc127 77.79,25.27 arc-152 71.82,26.42 arc68 68.45,30.86 arc-40 v43.63,50.86
CLED9  (via drill 0.3)
  Top 0.254: IC4.25 147.45,51.31 arc-73 147.32,52.2 arc57 147.32,53.09 arc80 146.69,53.34 arc-235 v146.81,54.1 | v71.12,31.75 arc125 CLED9.C
  Bottom 0.254: v146.81,54.1 arc90 146.94,53.98 147.45,53.98 arc-90 149.22,52.2 149.22,51.44 arc-90 143.51,45.72 142.24,45.72 arc90 140.97,44.45 arc-90 123.06,26.54 76.33,26.54 arc-90 v71.12,31.75
CLED10  (via drill 0.3)
  Top 0.254: IC4.26 146.94,50.8 arc-64 v146.49,52.64 | v105.41,27.94 arc-29 CLED10.C
  Bottom 0.254: v146.49,52.64 arc-221 147.38,52.32 140.97,45.72 arc-35 v105.41,27.94
CLED11
  Top 0.254: CLED11.C 131.52,37.54 arc-90 128.27,34.29 arc-106 124.46,39.37 arc-57 132.08,46.99 arc35 139.7,52.07 arc-74 144.78,53.34 146.81,50.04 IC4.27
CLED12  (via drill 0.3)
  Top 0.254: IC4.28 145.82,50.14 arc-27 145.42,50.79 v145.29,51.18 | v155.57,62.48 arc124 CLED12.C
  Bottom 0.254: v145.29,51.18 145.29,51.24 arc-90 150.37,57.02 150.11,57.02 arc90 v155.57,62.48
COL1
  Top 0.254: IC1.5 129.54,159.38 LED1.K
COL2
  Top 0.254: IC1.6 129.79,160.02 184.66,104.9 LED2.K
COL3
  Top 0.254: IC1.7 130.05,160.66 183.13,114.17 LED3.K
COL4
  Top 0.254: IC1.8 130.81,160.91 LED4.K
COL5
  Top 0.254: IC1.9 131.57,161.16 177.04,132.08 LED5.K
COL6
  Top 0.254: IC1.10 131.7,161.93 172.59,140.84 LED6.K
COL7
  Top 0.254: IC1.11 132.33,162.31 167.39,148.84 LED7.K
COL8
  Top 0.254: IC1.12 131.83,163.32 161.29,155.96 LED8.K
COL9
  Top 0.254: IC1.13 132.08,163.96 154.31,162.69 LED9.K
COL10
  Top 0.254: IC1.14 132.33,164.59 146.69,168.66 LED10.K
COL11
  Top 0.254: IC1.15 132.21,165.35 LED11.K
COL12
  Top 0.254: IC1.16 LED12.K
COL13
  Top 0.254: IC1.17 LED13.K
COL14
  Top 0.254: IC1.18 122.94,169.93 LED14.K
COL15  (1 unrouted)
  Top 0.254: IC1.19 123.19,169.04 122.43,169.67 113.28,179.96 103.51,183.9 102.23,185.04
COL16
  Top 0.254: LED16.K 94.23,184.53 112.65,179.58 121.79,169.67 122.81,168.53 IC1.20
COL17
  Top 0.254: LED17.K 85.09,184.15 112.52,178.94 122.56,167.89 IC1.21
COL18  (1 unrouted)
  Top 0.254: IC1.22 122.3,167.39 121.16,168.53 112.14,178.31 75.95,182.63 73.79,183.13
COL19
  Top 0.254: IC1.23 122.17,166.62 111.76,177.8 78.23,179.83 66.68,179.83 LED19.K
COL20
  Top 0.254: IC1.24 121.67,166.12 113.6,174.77 arc45 107.81,177.4 77.98,178.31 58.04,176.91 LED20.K
COL21
  Top 0.254: LED21.K 49.53,172.72 78.36,177.55 105.91,176.8 arc-46 114.47,172.93 121.03,165.86 IC1.25
COL22
  Top 0.254: IC1.26 120.52,165.35 114.97,171.33 arc46 104.22,176.12 78.74,176.53 41.4,167.51 LED22.K
COL23
  Top 0.254: IC1.27 120.4,164.72 115.64,169.65 arc46 101.84,175.45 78.74,175.26 LED23.K
COL24
  Top 0.254: IC1.28 120.14,163.96 116.16,168.09 arc48 99.86,174.69 78.74,173.99 51.05,165.74 LED24.K
COL25
  Top 0.254: IC3.5 27.56,71.75 arc-9 26.16,77.47 26.16,81.3 arc52 19.94,93.96 17.42,95.9 arc-56 13.67,104.21 15.62,133.73 20.95,144.02 LED25.K
COL26
  Top 0.254: IC3.6 27.43,69.72 25.53,77 arc-15 25.4,77.96 25.4,79.85 arc55 19.04,92.12 15.52,94.6 arc-59 11.54,102.96 13.97,138.43 LED26.K
COL27
  Top 0.254: IC3.7 27.31,67.95 24.66,75.89 arc-18 24.13,79.13 24.13,79.67 arc52 18.84,90.46 13.75,94.4 arc-52 10.05,101.99 10.16,128.27 LED27.K
COL28
  Top 0.254: IC3.8 26.8,67.18 23.33,76.24 arc-21 22.86,78.78 arc50 18.04,89.16 11.46,94.71 arc-44 8.7,99.96 LED28.K
COL29
  Top 0.254: IC3.9 26.67,65.66 22.32,75.78 arc-22 21.55,79.31 arc46 18.13,86.87 10.39,93.95 arc-34 7.4,98.98 LED29.K
COL30
  Top 0.254: LED30.K 15.75,78.61 21.19,73.17 arc-19 23.49,69.96 26.67,63.5 IC3.10
COL31
  Top 0.254: IC3.11 26.29,62.74 LED31.K
COL32
  Top 0.254: IC3.12 26.66,59.71 arc26 24.35,63.2 LED32.K
COL33
  Top 0.254: IC3.13 25.8,59.97 arc35 24.13,61.92 4.95,73.79 LED33.K
COL34  (1 unrouted)
  Top 0.254: IC3.14 25.16,59.96 arc56 24.64,60.42 7.49,64.52
COL35  (1 unrouted)
  Top 0.254: IC3.15 24.95,58.76 arc71 23.66,59.69 20.55,59.69 arc45 11.05,55.75
COL36
  Top 0.254: IC3.16 24.55,56.28 LED36.K
COL37
  Top 0.254: IC3.17 LED37.K
COL38
  Top 0.254: IC3.18 28.52,48.91 arc-25 29.03,44.96 27.94,33.02 LED38.K
COL39
  Top 0.254: IC3.19 30.36,46.02 arc-10 30.54,45.4 34.29,26.67 LED39.K
COL40
  Top 0.254: IC3.20 33.02,40.64 41.91,21.59 LED40.K
COL41
  Top 0.254: IC3.21 30.48,49.53 49.14,17.19 arc-34 49.47,15.73 LED41.K
COL42
  Top 0.254: IC3.22 30.99,49.91 57.82,12.27 arc-35 58.42,10.4 LED42.K
COL43  (1 unrouted)
  Top 0.254: IC3.23 31.37,50.55 65.62,10.42 arc-37 67.04,6.88 67.06,6.6
COL44  (1 unrouted)
  Top 0.254: IC3.24 32,50.8 74.68,7.88 arc-45 76.2,4.19
COL45
  Top 0.254: LED45.K 85.69,3.22 83.82,5.08 arc-45 75.15,8.67 33.02,50.8 arc-28 IC3.25
COL46
  Top 0.254: IC3.26 33.15,51.56 70.35,15.67 arc44 93.43,6.35 arc-72 94.15,5.83 LED46.K
COL47
  Top 0.254: LED47.K arc67 98.02,7.62 92.48,7.62 arc-43 73.07,15.24 35.31,50.29 33.66,51.94 IC3.27
COL48
  Top 0.254: IC3.28 34.16,52.32 35.81,50.67 73.48,16.06 arc43 91.87,8.89 106.98,8.89 arc-59 LED48.K
COL49
  Top 0.254: LED49.K 122.94,9.27 153.35,40.66 arc91 153.3,43.1 IC4.5
COL50  (1 unrouted)
  Top 0.254: IC4.6 154.07,43.24 arc-89 154.13,40.52 131.19,16.38 132.21,11.05
COL51
  Top 0.254: IC4.7 154.7,43.52 arc-89 154.76,40.49 137.92,22.48 140.84,15.37 arc-332 LED51.K
COL52
  Top 0.254: IC4.8 155.36,43.7 arc-87 155.4,40.34 145.54,29.72 LED52.K
COL53
  Top 0.254: IC4.9 156.3,43.58 arc-85 156.31,40.48 150.75,34.42 LED53.K
COL54
  Top 0.254: IC4.10 155.83,45.15 arc-20 160.1,39.19 162.69,33.78 arc79 LED54.K
COL55
  Top 0.254: 154.94,46.99 IC4.11 155.75,46.13 arc34 163.19,42.27 LED55.K
COL56
  Top 0.254: IC4.12 155.59,47.2 arc66 163.78,45.48 LED56.K
COL57  (1 unrouted)
  Top 0.254: IC4.13 arc81 162.95,47.18 177.67,58.04 178.05,57.79
COL58  (1 unrouted)
  Top 0.254: IC4.14 arc93 162.21,48.27 178.82,66.29 181.23,66.93
COL59  (1 unrouted)
  Top 0.254: IC4.15 arc98 161.45,49.01 181.61,76.2 183.77,76.07
COL60  (1 unrouted)
  Top 0.254: IC4.16 arc100 160.89,49.57 183.77,84.96 184.91,85.73
GND  (via drill 0.3, 0.71)  (3 unrouted)
  Top 0.254: R2.1 48.26,46.99
  other vias: 168.91,93.98 17.78,93.98 93.98,170.18 93.98,17.78
  pour Top (isolate 0.381): 94.3,187.96 arc90 0,93.66 arc90 93.66,0 arc90 187.96,94.3 arc90
MISO  (via drill 0.3)
  Top 0.254: SV1.2 arc90 26.67,125.73 arc85 41.91,139.7 arc-62 v44.45,144.27 | v53.72,146.56 53.72,147.99 arc90 IC2.16
  Bottom 0.254: v44.45,144.27 51.18,144.02 arc90 v53.72,146.56
MOSI
  Top 0.254: SV1.1 arc90 25.4,124.46 31.75,124.46 arc90 44.45,137.16 44.45,139.7 arc-67 48.9,145.16 arc2 52.45,145.86 arc90 52.8,146.4 IC2.15
N$1
  Top 0.254: R2.2 36.8,51.93 arc-40 36.13,52.71 IC3.31
N$2
  Top 0.254: JP1.1 145.15,49.28 arc-45 IC4.29
N$4
  Bottom 0.254: BAT1.3 arc-90 22.86,76.2 22.86,90.17 arc90 19.05,93.98 BAT3.2
N$5
  Bottom 0.254: BAT2.2 arc-90 100.33,176.53 115.57,176.53 arc-101 161.67,116.21 arc33 BAT4.3
N$7
  Top 0.254: IC2.7 41.31,150.4 X1.2 40.51,150.61 C3.1
N$8
  Top 0.254: C4.1 X1.1 40.04,146.69 arc90 IC2.8
N$13
  Top 0.254: IC1.31 121.28,161.29 121.03,160.53 R1.2
N$64
  Top 0.254: IC4.31 145.42,47.87 146.05,47.24 146.05,47.12 144.53,45.59 144.08,45.59 R3.2
RST  (via drill 0.3)
  Top 0.254: S1.3 29.19,146.66 arc45 27.94,143.65 SV1.5 | v49.53,161.29 50.12,160.7 arc-45 50.4,160.02 IC2.29
  Bottom 0.254: v49.53,161.29 45.58,161.29 arc45 42.57,160.04 28.26,145.73 28.26,132.4 SV1.5
SCK  (via drill 0.3)
  Top 0.254: SV1.3 22.86,129.54 arc90 25.4,127 arc54 38.1,133.48 arc37 41.28,141.1 arc-90 v45.85,145.67 | v55.12,148.59 arc84 IC2.17
  Bottom 0.254: v45.85,145.67 arc49 v55.12,148.59
SCLK  (via drill 0.3)  (4 unrouted)
  Top 0.254: IC3.3 30.99,64.9 arc-174 v37.59,67.69 | IC4.3 152.11,42.41 arc-90 152.11,41.62 149.86,39.37 139.7,39.37 arc-90 v133.35,45.72 | IC2.24 55.09,155.55 arc-90 57.53,157.99 59.06,157.99 arc-90 62.74,154.31 arc-20 v61.47,147.07
  Bottom 0.254: v133.35,45.72 133.48,45.85 | v61.47,147.07 61.21,146.94 | 93.98,156.21 arc-180 93.98,31.75 arc-180 93.98,156.21
SIN  (1 unrouted)
SOUT  (via drill 0.3)  (2 unrouted)
  Top 0.254: IC3.4 30.35,64.77 arc-153 v37.97,69.85 | v119.63,163.58 IC1.29 | v111.38,152.4 arc69 v116.97,156.59
  Bottom 0.254: v116.97,156.59 v119.63,163.58 | v111.38,152.4 111.25,152.4 | 93.98,33.02 arc180 93.98,154.94 arc180 93.98,33.02
SOUT_2
  Top 0.254: IC3.29 34.93,52.32 75.92,15.04 arc42 88.53,10.16 121.92,10.16 149.73,38.23 152.88,41.48 arc89 152.87,42.58 IC4.4
VCC  (via drill 0.3)  (68 unrouted)
  Top 0.254: CLED6.A 30.71,116.17 arc41 26.92,114.74 BAT3.3 arc-90 28.68,95.78 CLED7.A | CLED3.A 110.67,164.92 BAT2.3 IC1.32 | v135,137.41 CLED2.A | v69.22,39.62 CLED9.A | IC4.32 136.81,47.4 arc90 128.27,38.86 arc90 129.16,37.97 CLED11.A | CLED12.A 144.17,61.32 arc-90 v144.02,61.47 | v151.26,112.84 CLED1.A v162.69,115.19 | v54.1,138.43 CLED5.A 54.14,143.04 arc90 58.42,147.32 arc94 IC2.18 51.15,150.4 arc-90 50.8,150.75 | v45.72,58.67 40.88,53.84 IC3.32 40.89,53.84 CLED8.A | 50.8,150.75 arc90 50.35,151.2 48.26,151.2 | 48.26,151.2 IC2.6 | 48.26,151.2 48.26,152.4 arc90 47.86,152.8 IC2.4 43.18,152.8 arc-45 42.5,153.08 42.28,153.3 arc-45 41.91,154.2 C1.1 C2.1 20.52,148.9 arc259 LED25.A | v97.41,34.42 CLED10.A | IC2.20 52.47,152 arc-90 52.07,152.4 arc180 50.8,152.4 50.8,150.75
  Bottom 0.254: 163.83,154.94 arc-131 93.98,1.27 arc-180 93.98,186.69 arc-49 163.83,154.94 | LED16.A 95.25,186.69 | LED36.A 13.08,48.77 | LED40.A 38.48,19.81 | LED37.A 18.29,40.64 | LED35.A 8.89,57.4 | LED38.A 24.26,32.89 | 30.99,26.04 LED39.A 31.12,26.04 | LED42.A 55.12,9.78 | LED43.A 64.26,6.22 | BAT3.3 3.81,106.68 LED30.A 2.03,105.41 | LED27.A 10.16,133.35 | 14.48,141.48 LED26.A 25.4,134.62 SV1.4 | LED25.A 19.81,149.35 | LED28.A 6.22,123.95 | LED54.A 161.93,30.99 | 26.67,157.48 LED24.A | v135,137.41 135,137.29 | v144.02,61.47 144.02,61.6 arc-90 144.15,61.72 | 33.02,163.7 LED23.A | v54.1,138.43 54.36,138.68 | 45.85,58.67 v45.72,58.67 | LED8.A 163.11,154.22 163.83,154.94 | LED7.A 169.67,147.45 | LED3.A 184.79,112.01 | LED60.A 186.06,83.06 | 184.4,73.53 LED59.A | LED32.A 1.78,85.47 | LED33.A 3.05,75.95 | LED34.A 5.46,66.68 | 3.68,114.55 LED29.A | 40.51,169.67 LED22.A | LED21.A 48.64,174.75 | LED20.A 57.4,179.07 | LED19.A 66.68,182.37 | 75.95,184.79 LED18.A | LED17.A 85.73,186.18 | LED6.A 174.75,139.19 | LED5.A 179.07,130.56 | 155.07,24.38 LED53.A | 147.45,18.42 LED52.A | LED55.A 168.28,38.61 | LED51.A 139.32,13.21 | LED46.A 92.71,1.4 | LED47.A 102.49,1.78 | LED45.A 83.19,2.03 | LED44.A 73.41,3.68 | LED50.A 130.56,8.89 | LED49.A 121.67,5.59 | 112.14,3.17 LED48.A | LED41.A 46.61,14.48 | LED31.A 1.27,95.25 | LED15.A 104.8,186.06 104.9,186.06 | LED14.A 114.23,184.28 114.3,184.28 | LED13.A arc60 124.46,181.61 | LED12.A arc60 133.35,177.8 | v162.69,115.19 arc32 LED4.A | v151.26,112.84 150.69,112.59 | 93.98,153.67 arc-180 93.98,34.29 arc-180 93.98,153.67
XLAT  (via drill 0.3)  (3 unrouted)
  Top 0.254: IC1.30 119.38,162.94 113.95,168.19 arc47 99,173.79 v78.74,172.72 57.15,162.56 55.08,161.53 arc63 54.61,160.76 arc-45 54.08,159.49 53.07,158.48 arc45 52.8,157.83 IC2.26
  Bottom 0.254: v78.74,172.72 78.74,162.43 arc90 83.31,157.86 | 93.98,158.75 arc180 93.98,29.21 arc180 93.98,158.75